# Altium schematic sheet spi_iic_uart.SchDoc
size A4
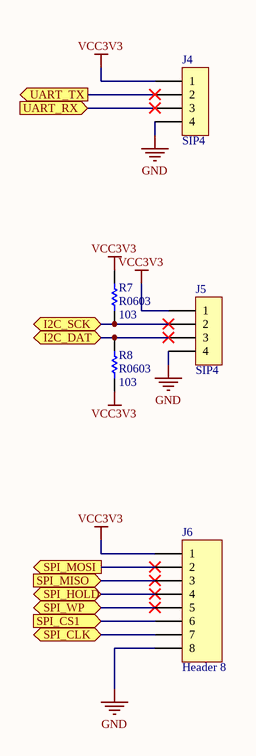
[diagram p0: spi_iic_uart.SchDoc]

## Parts
J4  SIP4  [SIP4-2.54]
J5  SIP4  [SIP4-2.54]
J6  Header 8  [HDR1X8]
R7  R0603  value 103  [R0603N]
R8  R0603  value 103  [R0603N]

## Ports
I2C_DAT (bidir), I2C_SCK (bidir), SPI_CLK (bidir), SPI_CS1 (in), SPI_HOLD, SPI_MISO (in), SPI_MOSI (out), SPI_WP, UART_RX (in), UART_TX (out)

## Nets
GND: J4.4 J5.4 J6.8
VCC3V3: J4.1 J5.1 J6.1 R7.2 R8.1
I2C_DAT: J5.3 R8.2 ; port I2C_DAT
I2C_SCK: J5.2 R7.1 ; port I2C_SCK
SPI_CLK: J6.7 ; port SPI_CLK
SPI_CS1: J6.6 ; port SPI_CS1
SPI_HOLD: J6.4 ; port SPI_HOLD
SPI_MISO: J6.3 ; port SPI_MISO
SPI_MOSI: J6.2 ; port SPI_MOSI
SPI_WP: J6.5 ; port SPI_WP
UART_RX: J4.3 ; port UART_RX
UART_TX: J4.2 ; port UART_TX

## Library data of the parts
J4 J5 = SIP4: jointbar
J6 = Header 8: Header, 8-Pin; LatestRevisionDate: 17-Jul-2002; LatestRevisionNote: Re-released for DXP Platform.; Publisher: Altium Limited
R7 R8 = Res Semi: Semiconductor Resistor